# Altium schematic sheet 30W_SMPS.SchDoc
size A4; SheetNumber: 1; SheetTotal: 1
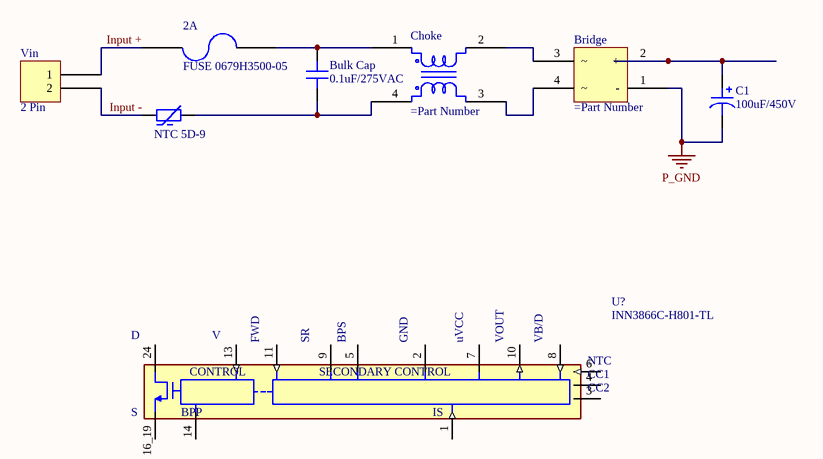
[diagram p0: 30W_SMPS.SchDoc]

## Parts
2A  FUSE 0679H3500-05
Bridge  (no value)
Bulk_Cap  0.1uF/275VAC
C1  100uF/450V
Choke  (no value)
NTC_5D-9  (no value)
U?  INN3866C-H801-TL  [IC_INN3866C-H801-TL]
Vin  2 Pin

## Nets
P_GND: Bridge.1(-) C1.2
Input +: 2A.1 Vin.1
Input -: NTC_5D-9.1 Vin.2
Net2A_2: 2A.2 Bulk_Cap.2 Choke.1
NetBridge_2: Bridge.2(+) C1.1
NetBridge_3: Bridge.3 Choke.2
NetBridge_4: Bridge.4 Choke.3
NetBulk_Cap_1: Bulk_Cap.1 Choke.4 NTC_5D-9.2

Not connected (* = marked no-connect by the designer): U? 1(IS) 2(GND) 3(CC2) 4(CC1) 5(BPS) 6(NTC) 7(UVCC) 8(VB/D) 9(SR) 10(VOUT) 11(FWD) 13(V) 14(BPP) 16_19(S) 24(D)

## Notes on the sheet
- (in symbol INN3866C-H801-TL) uVCC; CONTROL; SECONDARY CONTROL

## Library data of the parts
Bridge = BOURNS CD-MBL1XXS
Bulk_Cap = Capacitor: SMT Capacitor
C1 = Polarised Capacitor: SMT Polarised Capacitor
Choke = LAIRD CMA0805
NTC_5D-9 = Thermistor: SMT Resistor
U? = INN3866C-H801-TL: MF: {'manufacturer': u'Power Integrations'}; Package: None; Price: None; Value: *; MP: INN3866C-H801-TL; Availability: Unavailable
2A = FUSE 0679H3500-05: Supplier 1: Arrow Electronics; Supplier Part Number 1: 0679H3500-05